# Altium project RK3576-SMC (021.0 A0).PrjPCB (part 3 of 3)

## Sheet RK3576-SMC.LPDDR4 (0021.0 A0).SchDoc
size 420 x 297 mm; Scale: -; DocumentType: Схема электрическая принципиальная; DocumentGOSTLIt1: ㅤ; DocumentGOSTLIt2: ㅤ; DocumentGOSTLIt3: ㅤ; DocumentGOSTNote: Элементы, отмеченные *, используются при трассировке печатной платы, в состав модуля не включаются; SheetNumber: 5; SheetTotal: 6; DocumentTypeShort: Э3; DocumentInvertoryNumber: ㅤ
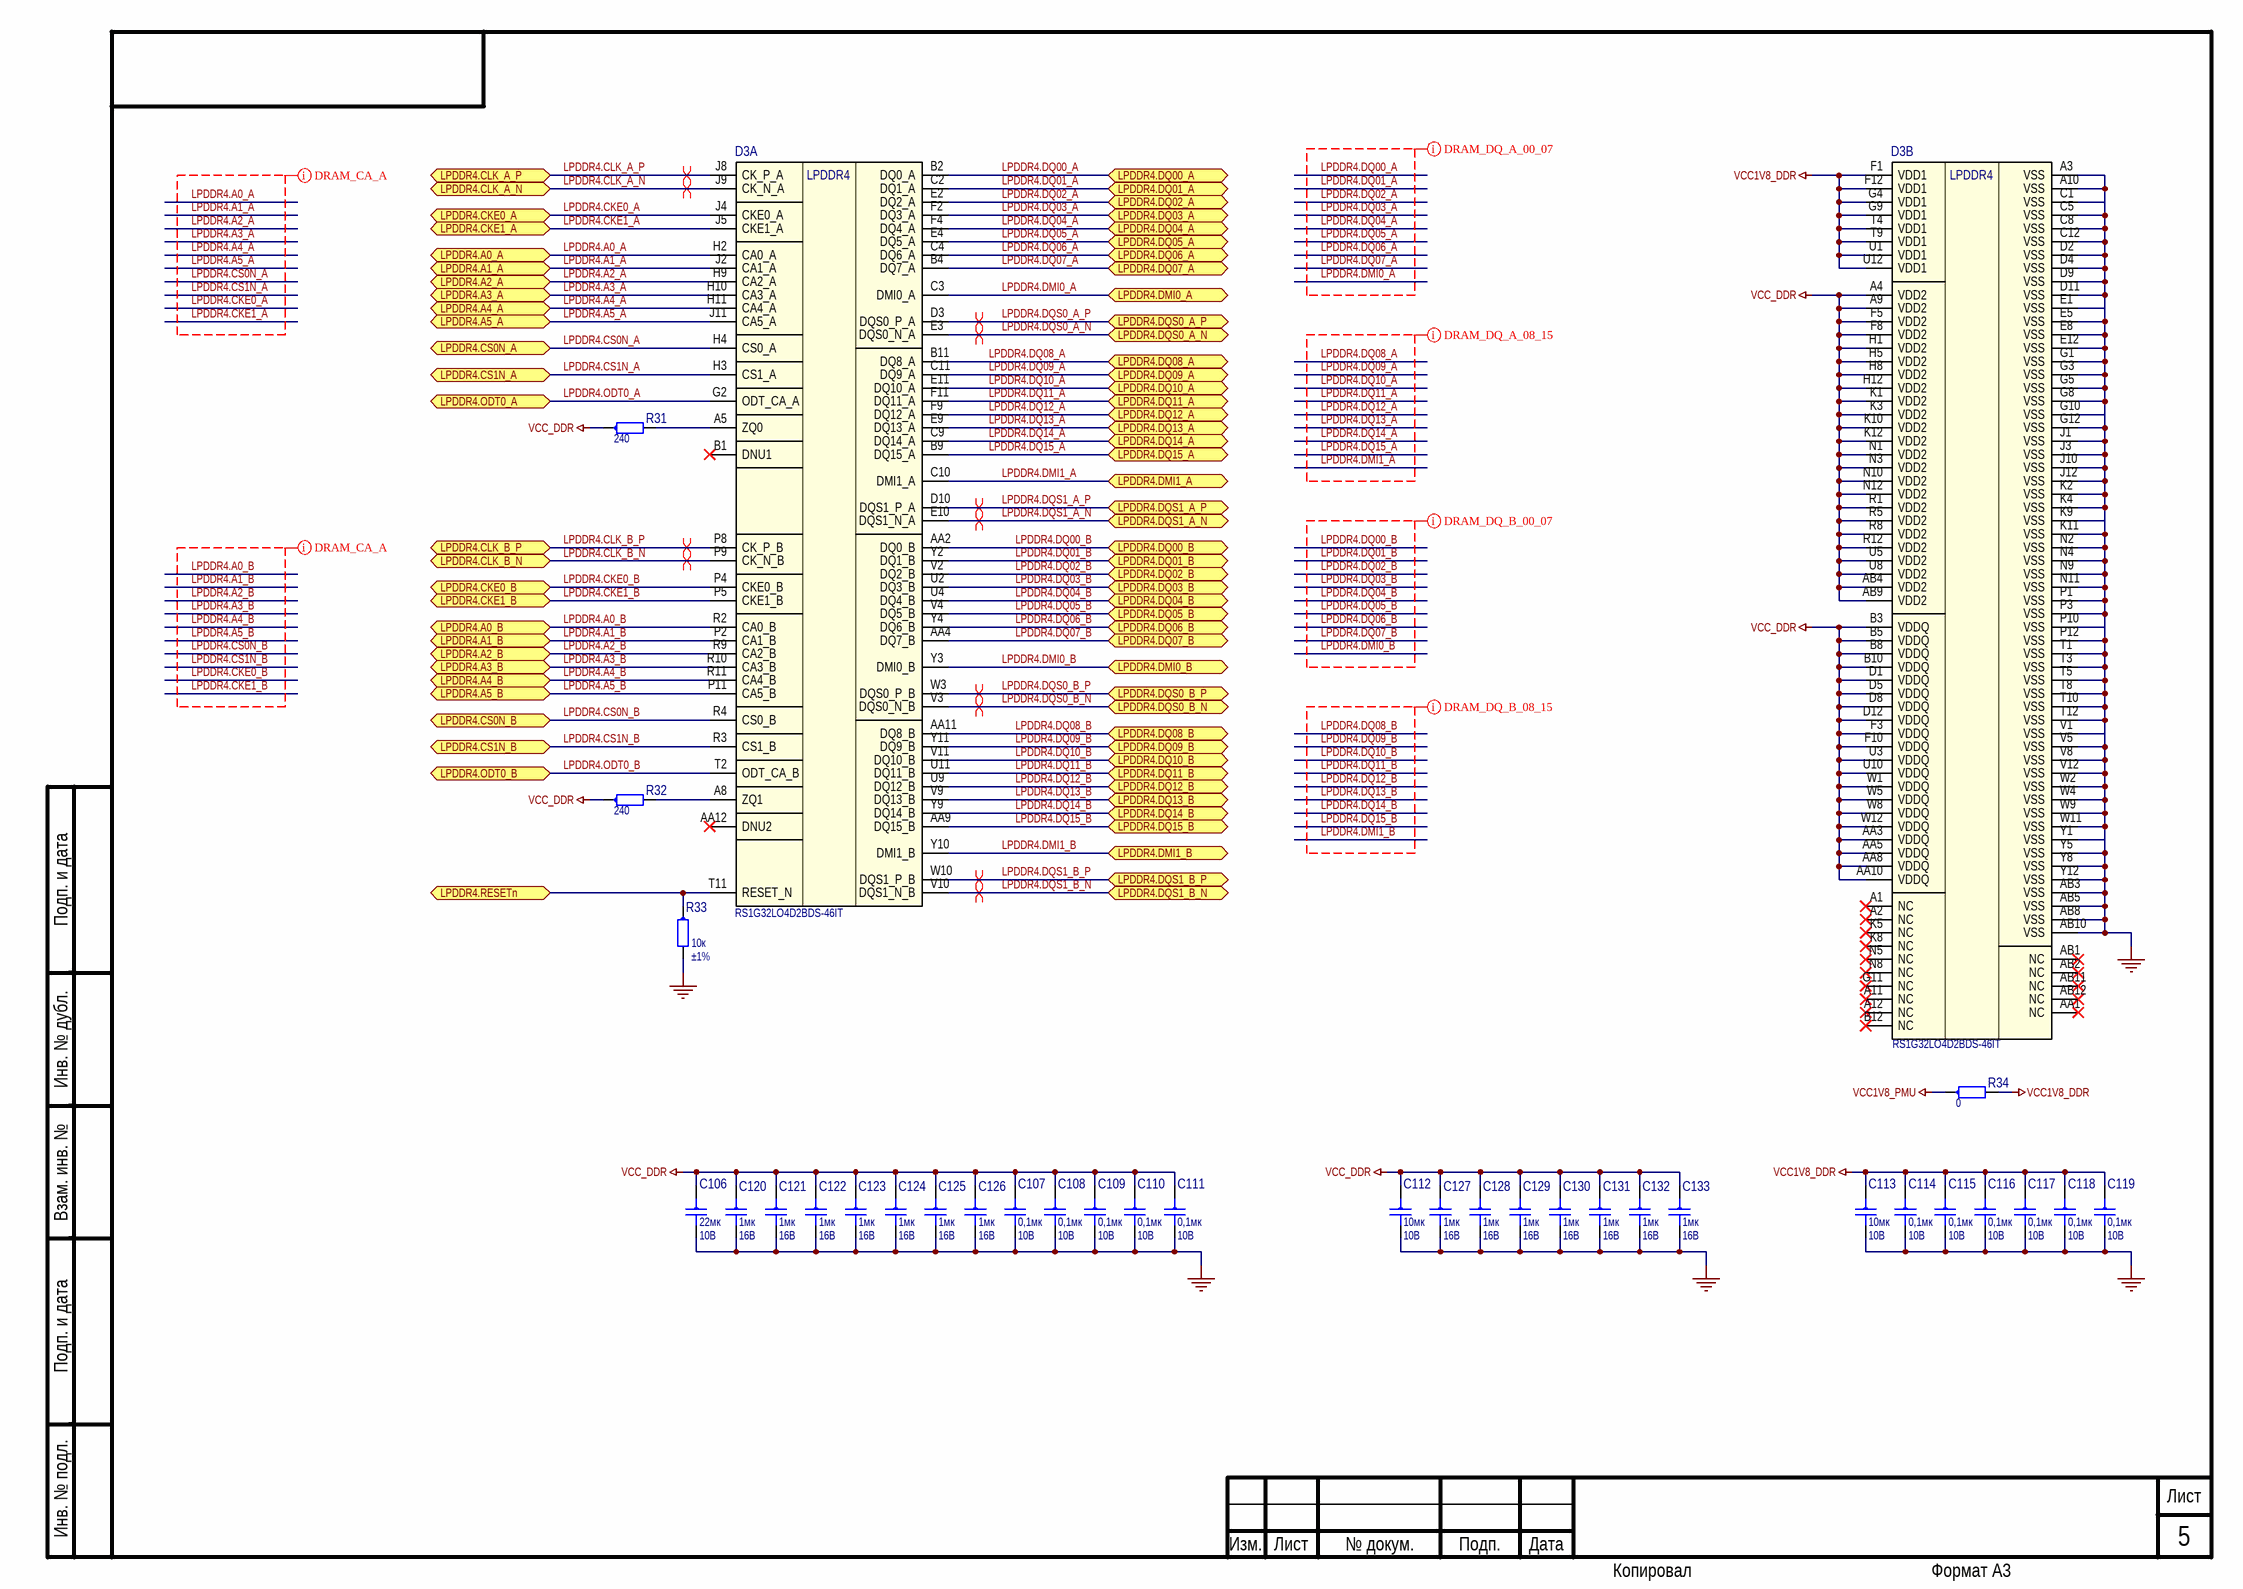
[diagram p5: RK3576-SMC.LPDDR4 (0021.0 A0).SchDoc]

### Parts
C106  22мк  Напряжение: 10В  [capc1608x80n]
C107  0,1мк  Напряжение: 10В  [capc1005x55n]
C108  0,1мк  Напряжение: 10В  [capc1005x55n]
C109  0,1мк  Напряжение: 10В  [capc1005x55n]
C110  0,1мк  Напряжение: 10В  [capc1005x55n]
C111  0,1мк  Напряжение: 10В  [capc1005x55n]
C112  10мк  Напряжение: 10В  [capc1608x100n]
C113  10мк  Напряжение: 10В  [capc1608x100n]
C114  0,1мк  Напряжение: 10В  [capc1005x55n]
C115  0,1мк  Напряжение: 10В  [capc1005x55n]
C116  0,1мк  Напряжение: 10В  [capc1005x55n]
C117  0,1мк  Напряжение: 10В  [capc1005x55n]
C118  0,1мк  Напряжение: 10В  [capc1005x55n]
C119  0,1мк  Напряжение: 10В  [capc1005x55n]
C120  1мк  Напряжение: 16В  [capc1005x55n]
C121  1мк  Напряжение: 16В  [capc1005x55n]
C122  1мк  Напряжение: 16В  [capc1005x55n]
C123  1мк  Напряжение: 16В  [capc1005x55n]
C124  1мк  Напряжение: 16В  [capc1005x55n]
C125  1мк  Напряжение: 16В  [capc1005x55n]
C126  1мк  Напряжение: 16В  [capc1005x55n]
C127  1мк  Напряжение: 16В  [capc1005x55n]
C128  1мк  Напряжение: 16В  [capc1005x55n]
C129  1мк  Напряжение: 16В  [capc1005x55n]
C130  1мк  Напряжение: 16В  [capc1005x55n]
C131  1мк  Напряжение: 16В  [capc1005x55n]
C132  1мк  Напряжение: 16В  [capc1005x55n]
C133  1мк  Напряжение: 16В  [capc1005x55n]
D3  RS1G32LO4D2BDS-46IT  [bga200c80x65p12x22_1000x1450x110]  (parts A,B of 2)
R31  240  [resc1005x40n]
R32  240  [resc1005x40n]
R33  10к  Точность: ±1%  [resc1005x40n]
R34  0  [resc1005x40n]

### Ports
LPDDR4.A0_A (bidir), LPDDR4.A0_B (bidir), LPDDR4.A1_A (bidir), LPDDR4.A1_B (bidir), LPDDR4.A2_A (bidir), LPDDR4.A2_B (bidir), LPDDR4.A3_A (bidir), LPDDR4.A3_B (bidir), LPDDR4.A4_A (bidir), LPDDR4.A4_B (bidir), LPDDR4.A5_A (bidir), LPDDR4.A5_B (bidir), LPDDR4.CKE0_A (bidir), LPDDR4.CKE0_B (bidir), LPDDR4.CKE1_A (bidir), LPDDR4.CKE1_B (bidir), LPDDR4.CLK_A_N (bidir), LPDDR4.CLK_A_P (bidir), LPDDR4.CLK_B_N (bidir), LPDDR4.CLK_B_P (bidir), LPDDR4.CS0N_A (bidir), LPDDR4.CS0N_B (bidir), LPDDR4.CS1N_A (bidir), LPDDR4.CS1N_B (bidir), LPDDR4.DMI0_A (bidir), LPDDR4.DMI0_B (bidir), LPDDR4.DMI1_A (bidir), LPDDR4.DMI1_B (bidir), LPDDR4.DQ00_A (bidir), LPDDR4.DQ00_B (bidir), LPDDR4.DQ01_A (bidir), LPDDR4.DQ01_B (bidir), LPDDR4.DQ02_A (bidir), LPDDR4.DQ02_B (bidir), LPDDR4.DQ03_A (bidir), LPDDR4.DQ03_B (bidir), LPDDR4.DQ04_A (bidir), LPDDR4.DQ04_B (bidir), LPDDR4.DQ05_A (bidir), LPDDR4.DQ05_B (bidir), LPDDR4.DQ06_A (bidir), LPDDR4.DQ06_B (bidir), LPDDR4.DQ07_A (bidir), LPDDR4.DQ07_B (bidir), LPDDR4.DQ08_A (bidir), LPDDR4.DQ08_B (bidir), LPDDR4.DQ09_A (bidir), LPDDR4.DQ09_B (bidir), LPDDR4.DQ10_A (bidir), LPDDR4.DQ10_B (bidir), LPDDR4.DQ11_A (bidir), LPDDR4.DQ11_B (bidir), LPDDR4.DQ12_A (bidir), LPDDR4.DQ12_B (bidir), LPDDR4.DQ13_A (bidir), LPDDR4.DQ13_B (bidir), LPDDR4.DQ14_A (bidir), LPDDR4.DQ14_B (bidir), LPDDR4.DQ15_A (bidir), LPDDR4.DQ15_B (bidir), LPDDR4.DQS0_A_N (bidir), LPDDR4.DQS0_A_P (bidir), LPDDR4.DQS0_B_N (bidir), LPDDR4.DQS0_B_P (bidir), LPDDR4.DQS1_A_N (bidir), LPDDR4.DQS1_A_P (bidir), LPDDR4.DQS1_B_N (bidir), LPDDR4.DQS1_B_P (bidir), LPDDR4.ODT0_A (bidir), LPDDR4.ODT0_B (bidir), LPDDR4.RESETn (bidir)

### Nets
DEV.GND: C106.2 C107.2 C108.2 C109.2 C110.2 C111.2 C112.2 C113.2 C114.2 C115.2 C116.2 C117.2 C118.2 C119.2 C120.2 C121.2 C122.2 C123.2 C124.2 C125.2 C126.2 C127.2 C128.2 C129.2 C130.2 C131.2 C132.2 C133.2 D3.A3(VSS) D3.A10(VSS) D3.AB3(VSS) D3.AB5(VSS) D3.AB8(VSS) D3.AB10(VSS) D3.C1(VSS) D3.C5(VSS) D3.C8(VSS) D3.C12(VSS) D3.D2(VSS) D3.D4(VSS) D3.D9(VSS) D3.D11(VSS) D3.E1(VSS) D3.E5(VSS) D3.E8(VSS) D3.E12(VSS) D3.G1(VSS) D3.G3(VSS) D3.G5(VSS) D3.G8(VSS) D3.G10(VSS) D3.G12(VSS) D3.J1(VSS) D3.J3(VSS) D3.J10(VSS) D3.J12(VSS) D3.K2(VSS) D3.K4(VSS) D3.K9(VSS) D3.K11(VSS) D3.N2(VSS) D3.N4(VSS) D3.N9(VSS) D3.N11(VSS) D3.P1(VSS) D3.P3(VSS) D3.P10(VSS) D3.P12(VSS) D3.T1(VSS) D3.T3(VSS) D3.T5(VSS) D3.T8(VSS) D3.T10(VSS) D3.T12(VSS) D3.V1(VSS) D3.V5(VSS) D3.V8(VSS) D3.V12(VSS) D3.W2(VSS) D3.W4(VSS) D3.W9(VSS) D3.W11(VSS) D3.Y1(VSS) D3.Y5(VSS) D3.Y8(VSS) D3.Y12(VSS) R33.2
VCC1V8_DDR: C113.1 C114.1 C115.1 C116.1 C117.1 C118.1 C119.1 D3.F1(VDD1) D3.F12(VDD1) D3.G4(VDD1) D3.G9(VDD1) D3.T4(VDD1) D3.T9(VDD1) D3.U1(VDD1) D3.U12(VDD1) R34.2
VCC1V8_PMU: R34.1
VCC_DDR: C106.1 C107.1 C108.1 C109.1 C110.1 C111.1 C112.1 C120.1 C121.1 C122.1 C123.1 C124.1 C125.1 C126.1 C127.1 C128.1 C129.1 C130.1 C131.1 C132.1 C133.1 D3.A4(VDD2) D3.A9(VDD2) D3.AA3(VDDQ) D3.AA5(VDDQ) D3.AA8(VDDQ) D3.AA10(VDDQ) D3.AB4(VDD2) D3.AB9(VDD2) D3.B3(VDDQ) D3.B5(VDDQ) D3.B8(VDDQ) D3.B10(VDDQ) D3.D1(VDDQ) D3.D5(VDDQ) D3.D8(VDDQ) D3.D12(VDDQ) D3.F3(VDDQ) D3.F5(VDD2) D3.F8(VDD2) D3.F10(VDDQ) D3.H1(VDD2) D3.H5(VDD2) D3.H8(VDD2) D3.H12(VDD2) D3.K1(VDD2) D3.K3(VDD2) D3.K10(VDD2) D3.K12(VDD2) D3.N1(VDD2) D3.N3(VDD2) D3.N10(VDD2) D3.N12(VDD2) D3.R1(VDD2) D3.R5(VDD2) D3.R8(VDD2) D3.R12(VDD2) D3.U3(VDDQ) D3.U5(VDD2) D3.U8(VDD2) D3.U10(VDDQ) D3.W1(VDDQ) D3.W5(VDDQ) D3.W8(VDDQ) D3.W12(VDDQ) R31.1 R32.1
LPDDR4.A0_A: D3.H2(CA0_A) ; port LPDDR4.A0_A
LPDDR4.A0_B: D3.R2(CA0_B) ; port LPDDR4.A0_B
LPDDR4.A1_A: D3.J2(CA1_A) ; port LPDDR4.A1_A
LPDDR4.A1_B: D3.P2(CA1_B) ; port LPDDR4.A1_B
LPDDR4.A2_A: D3.H9(CA2_A) ; port LPDDR4.A2_A
LPDDR4.A2_B: D3.R9(CA2_B) ; port LPDDR4.A2_B
LPDDR4.A3_A: D3.H10(CA3_A) ; port LPDDR4.A3_A
LPDDR4.A3_B: D3.R10(CA3_B) ; port LPDDR4.A3_B
LPDDR4.A4_A: D3.H11(CA4_A) ; port LPDDR4.A4_A
LPDDR4.A4_B: D3.R11(CA4_B) ; port LPDDR4.A4_B
LPDDR4.A5_A: D3.J11(CA5_A) ; port LPDDR4.A5_A
LPDDR4.A5_B: D3.P11(CA5_B) ; port LPDDR4.A5_B
LPDDR4.CKE0_A: D3.J4(CKE0_A) ; port LPDDR4.CKE0_A
LPDDR4.CKE0_B: D3.P4(CKE0_B) ; port LPDDR4.CKE0_B
LPDDR4.CKE1_A: D3.J5(CKE1_A) ; port LPDDR4.CKE1_A
LPDDR4.CKE1_B: D3.P5(CKE1_B) ; port LPDDR4.CKE1_B
LPDDR4.CLK_A_N: D3.J9(CK_N_A) ; port LPDDR4.CLK_A_N
LPDDR4.CLK_A_P: D3.J8(CK_P_A) ; port LPDDR4.CLK_A_P
LPDDR4.CLK_B_N: D3.P9(CK_N_B) ; port LPDDR4.CLK_B_N
LPDDR4.CLK_B_P: D3.P8(CK_P_B) ; port LPDDR4.CLK_B_P
LPDDR4.CS0N_A: D3.H4(CS0_A) ; port LPDDR4.CS0N_A
LPDDR4.CS0N_B: D3.R4(CS0_B) ; port LPDDR4.CS0N_B
LPDDR4.CS1N_A: D3.H3(CS1_A) ; port LPDDR4.CS1N_A
LPDDR4.CS1N_B: D3.R3(CS1_B) ; port LPDDR4.CS1N_B
LPDDR4.DMI0_A: D3.C3(DMI0_A) ; port LPDDR4.DMI0_A
LPDDR4.DMI0_B: D3.Y3(DMI0_B) ; port LPDDR4.DMI0_B
LPDDR4.DMI1_A: D3.C10(DMI1_A) ; port LPDDR4.DMI1_A
LPDDR4.DMI1_B: D3.Y10(DMI1_B) ; port LPDDR4.DMI1_B
LPDDR4.DQ00_A: D3.B2(DQ0_A) ; port LPDDR4.DQ00_A
LPDDR4.DQ00_B: D3.AA2(DQ0_B) ; port LPDDR4.DQ00_B
LPDDR4.DQ01_A: D3.C2(DQ1_A) ; port LPDDR4.DQ01_A
LPDDR4.DQ01_B: D3.Y2(DQ1_B) ; port LPDDR4.DQ01_B
LPDDR4.DQ02_A: D3.E2(DQ2_A) ; port LPDDR4.DQ02_A
LPDDR4.DQ02_B: D3.V2(DQ2_B) ; port LPDDR4.DQ02_B
LPDDR4.DQ03_A: D3.F2(DQ3_A) ; port LPDDR4.DQ03_A
LPDDR4.DQ03_B: D3.U2(DQ3_B) ; port LPDDR4.DQ03_B
LPDDR4.DQ04_A: D3.F4(DQ4_A) ; port LPDDR4.DQ04_A
LPDDR4.DQ04_B: D3.U4(DQ4_B) ; port LPDDR4.DQ04_B
LPDDR4.DQ05_A: D3.E4(DQ5_A) ; port LPDDR4.DQ05_A
LPDDR4.DQ05_B: D3.V4(DQ5_B) ; port LPDDR4.DQ05_B
LPDDR4.DQ06_A: D3.C4(DQ6_A) ; port LPDDR4.DQ06_A
LPDDR4.DQ06_B: D3.Y4(DQ6_B) ; port LPDDR4.DQ06_B
LPDDR4.DQ07_A: D3.B4(DQ7_A) ; port LPDDR4.DQ07_A
LPDDR4.DQ07_B: D3.AA4(DQ7_B) ; port LPDDR4.DQ07_B
LPDDR4.DQ08_A: D3.B11(DQ8_A) ; port LPDDR4.DQ08_A
LPDDR4.DQ08_B: D3.AA11(DQ8_B) ; port LPDDR4.DQ08_B
LPDDR4.DQ09_A: D3.C11(DQ9_A) ; port LPDDR4.DQ09_A
LPDDR4.DQ09_B: D3.Y11(DQ9_B) ; port LPDDR4.DQ09_B
LPDDR4.DQ10_A: D3.E11(DQ10_A) ; port LPDDR4.DQ10_A
LPDDR4.DQ10_B: D3.V11(DQ10_B) ; port LPDDR4.DQ10_B
LPDDR4.DQ11_A: D3.F11(DQ11_A) ; port LPDDR4.DQ11_A
LPDDR4.DQ11_B: D3.U11(DQ11_B) ; port LPDDR4.DQ11_B
LPDDR4.DQ12_A: D3.F9(DQ12_A) ; port LPDDR4.DQ12_A
LPDDR4.DQ12_B: D3.U9(DQ12_B) ; port LPDDR4.DQ12_B
LPDDR4.DQ13_A: D3.E9(DQ13_A) ; port LPDDR4.DQ13_A
LPDDR4.DQ13_B: D3.V9(DQ13_B) ; port LPDDR4.DQ13_B
LPDDR4.DQ14_A: D3.C9(DQ14_A) ; port LPDDR4.DQ14_A
LPDDR4.DQ14_B: D3.Y9(DQ14_B) ; port LPDDR4.DQ14_B
LPDDR4.DQ15_A: D3.B9(DQ15_A) ; port LPDDR4.DQ15_A
LPDDR4.DQ15_B: D3.AA9(DQ15_B) ; port LPDDR4.DQ15_B
LPDDR4.DQS0_A_N: D3.E3(DQS0_N_A) ; port LPDDR4.DQS0_A_N
LPDDR4.DQS0_A_P: D3.D3(DQS0_P_A) ; port LPDDR4.DQS0_A_P
LPDDR4.DQS0_B_N: D3.V3(DQS0_N_B) ; port LPDDR4.DQS0_B_N
LPDDR4.DQS0_B_P: D3.W3(DQS0_P_B) ; port LPDDR4.DQS0_B_P
LPDDR4.DQS1_A_N: D3.E10(DQS1_N_A) ; port LPDDR4.DQS1_A_N
LPDDR4.DQS1_A_P: D3.D10(DQS1_P_A) ; port LPDDR4.DQS1_A_P
LPDDR4.DQS1_B_N: D3.V10(DQS1_N_B) ; port LPDDR4.DQS1_B_N
LPDDR4.DQS1_B_P: D3.W10(DQS1_P_B) ; port LPDDR4.DQS1_B_P
LPDDR4.ODT0_A: D3.G2(ODT_CA_A) ; port LPDDR4.ODT0_A
LPDDR4.ODT0_B: D3.T2(ODT_CA_B) ; port LPDDR4.ODT0_B
NetD3_A5: D3.A5(ZQ0) R31.2
NetD3_A8: D3.A8(ZQ1) R32.2
NetD3_T11: D3.T11(RESET_N) R33.1 ; port LPDDR4.RESETn

Not connected (* = marked no-connect by the designer): D3 A1(NC)* A2(NC)* A11(NC)* A12(NC)* AA1(NC)* AA12(DNU2)* AB1(NC)* AB2(NC)* AB11(NC)* AB12(NC)* B1(DNU1)* B12(NC)* G11(NC)* K5(NC)* K8(NC)* N5(NC)* N8(NC)*

### Layout directives
differential pair; differential pair class LPDDR4_STROBE0_A_Diff; rule Differential Pairs Routing [Pref Gap = 0.15mm    Min Gap  = 0.15mm    Max Gap  = 0.15mmPref Width = 0.15mm    Min Width  = 0.15mm    Max Width  = 0.15mm]: LPDDR4.DQS0_A_N, LPDDR4.DQS0_A_P
net class DRAM_DQ_A_00_07; rule Length Constraint [Min Length = 0mm    Max Length = 150mm]; rule Width Constraint [Pref Impedance = 50,00ohms    Min Impedance = 50,00ohms    Max Impedance = 50,00ohms]: LPDDR4.A0_A, LPDDR4.A0_B, LPDDR4.A1_A, LPDDR4.A1_B, LPDDR4.A2_A, LPDDR4.A2_B, LPDDR4.A3_A, LPDDR4.A3_B, LPDDR4.A4_A, LPDDR4.A4_B, LPDDR4.A5_A, LPDDR4.A5_B, LPDDR4.CKE0_A, LPDDR4.CKE0_B, LPDDR4.CKE1_A, LPDDR4.CKE1_B, LPDDR4.CS0N_A, LPDDR4.CS0N_B, LPDDR4.CS1N_A, LPDDR4.CS1N_B, LPDDR4.DMI0_A, LPDDR4.DQ00_A, LPDDR4.DQ01_A, LPDDR4.DQ02_A, LPDDR4.DQ03_A, LPDDR4.DQ04_A, LPDDR4.DQ05_A, LPDDR4.DQ06_A, LPDDR4.DQ07_A
net class DRAM_DQ_A_08_15; rule Length Constraint [Min Delay = 1ps    Max Delay = 1ps]; rule Width Constraint [Pref Impedance = 50,00ohms    Min Impedance = 50,00ohms    Max Impedance = 50,00ohms]: LPDDR4.DMI1_A, LPDDR4.DQ08_A, LPDDR4.DQ09_A, LPDDR4.DQ10_A, LPDDR4.DQ11_A, LPDDR4.DQ12_A, LPDDR4.DQ13_A, LPDDR4.DQ14_A, LPDDR4.DQ15_A
differential pair; differential pair class LPDDR4_STROBE1_A_Diff; rule Differential Pairs Routing [Pref Gap = 0.15mm    Min Gap  = 0.15mm    Max Gap  = 0.15mmPref Width = 0.15mm    Min Width  = 0.15mm    Max Width  = 0.15mm]: LPDDR4.DQS1_A_N, LPDDR4.DQS1_A_P
differential pair; differential pair class LPDDR4_STROBE0_B_Diff; rule Differential Pairs Routing [Pref Gap = 0.15mm    Min Gap  = 0.15mm    Max Gap  = 0.15mmPref Width = 0.15mm    Min Width  = 0.15mm    Max Width  = 0.15mm]: LPDDR4.DQS0_B_N, LPDDR4.DQS0_B_P
net class DRAM_DQ_B_00_07; rule Length Constraint [Min Length = 0mm    Max Length = 150mm]; rule Width Constraint [Pref Impedance = 50,00ohms    Min Impedance = 50,00ohms    Max Impedance = 50,00ohms]: LPDDR4.DMI0_B, LPDDR4.DQ00_B, LPDDR4.DQ01_B, LPDDR4.DQ02_B, LPDDR4.DQ03_B, LPDDR4.DQ04_B, LPDDR4.DQ05_B, LPDDR4.DQ06_B, LPDDR4.DQ07_B
net class DRAM_DQ_B_08_15; rule Length Constraint [Min Delay = 1ps    Max Delay = 1ps]; rule Width Constraint [Pref Impedance = 50,00ohms    Min Impedance = 50,00ohms    Max Impedance = 50,00ohms]: LPDDR4.DMI1_B, LPDDR4.DQ08_B, LPDDR4.DQ09_B, LPDDR4.DQ10_B, LPDDR4.DQ11_B, LPDDR4.DQ12_B, LPDDR4.DQ13_B, LPDDR4.DQ14_B, LPDDR4.DQ15_B
differential pair; differential pair class LPDDR4_STROBE1_B_Diff; rule Differential Pairs Routing [Pref Gap = 0.15mm    Min Gap  = 0.15mm    Max Gap  = 0.15mmPref Width = 0.15mm    Min Width  = 0.15mm    Max Width  = 0.15mm]: LPDDR4.DQS1_B_N, LPDDR4.DQS1_B_P
differential pair; differential pair class LPDDR4.CLK_A; rule Differential Pairs Routing [Pref Gap = 0.15mm    Min Gap  = 0.15mm    Max Gap  = 0.15mmPref Width = 0.15mm    Min Width  = 0.15mm    Max Width  = 0.15mm]: LPDDR4.CLK_A_N, LPDDR4.CLK_A_P
differential pair; differential pair class LPDDR4.CLK_B; rule Differential Pairs Routing [Pref Gap = 0.15mm    Min Gap  = 0.15mm    Max Gap  = 0.15mmPref Width = 0.15mm    Min Width  = 0.15mm    Max Width  = 0.15mm]: LPDDR4.CLK_B_N, LPDDR4.CLK_B_P

### Notes on the sheet
- Подп. и дата
- Инв. № дубл.
- Взам. инв. №
- Инв. № подл.
- Изм.
- Лист
- № докум.
- Подп.
- Дата
- Копировал
- Формат А3
- (in symbol RS1G32LO4D2BDS-46IT, part A) LPDDR4
- (in symbol RS1G32LO4D2BDS-46IT, part B) LPDDR4

### Library data of the parts
C106 = GRM187R61A226ME15D: Part_ID: ATB-00599; Manufacturer: Murata; Schematic_Part: C_min_val,C_min,C_val,C; Тип ЭКБ: Конденсаторы; Наименование: 0603-X5R-10V-22uF±20%; Тип компонента: Конденсатор керамический; Value: 22uF; Voltage: 10V; Температура: -55 +85; Тип корпуса: Chip; Видоразмер: 1608; Вариант установки: Поверхностный; Код ERP: E2-00012963; Photo: Murata_GRM155.jpg; Автор: Чепиков И.В.; Точность: 20%; Device: 0603-X5R-10V-22uF±20%_Murata; Library Ref 2: C; Library Ref 3: Cshort; Part Number: GRM187R61A226ME15D; Datasheet: GRM187R61A226ME15.pdf; Номинал: 22мк; Part_Number: GRM187R61A226ME15D; PCB_Footprint: capc1608x80n; Weight: 0.0091; Height: 0.8; Производитель: Murata; Website: https://www.murata.com/en-us/products/productdetail?partno=GRM187R61A226ME15%23; Дата: 03.09.2024; ComponentLink1Description: GRM187R61A226ME15.pdf; ComponentLink1URL: https://www.murata.com/en-us/products/productdetail?partno=GRM187R61A226ME15%23; NameFromManufacturer: GRM187R61A226ME15D; Original PN: GRM187R61A226ME15D
C107-C111 C114-C119 = C0402C104K8RAC: Part_ID: ATB-04706; Manufacturer: Kemet; Schematic_Part: C_min_val,C_min,C_val,C; Тип ЭКБ: Конденсаторы; Наименование: 0402-X7R-10V-100nF±10%; Тип компонента: Конденсатор керамический; Value: 100nF; Voltage: 10V; Температура: -55 +125; PCB_Footprint: capc1005x55,capc1005x55n; Тип корпуса: Chip; Видоразмер: 1005; Вариант установки: Поверхностный; Photo: Kemet_C0402-C2225.jpg; Автор: Чепиков И.В.; Точность: 10%; Device: 0402-X7R-10V-100nF±10%_Kemet; Library Ref 2: C; Library Ref 3: Cshort; Part Number: C0402C104K8RAC; Datasheet: Kemet_6.3-250V_X7R.pdf; Номинал: 0,1мк; Part_Number: C0402C104K8RAC; Height: 0.55; Производитель: Kemet; Website: https://content.kemet.com/datasheets/KEM_C1002_X7R_SMD.pdf; Дата: 16.10.2024; ComponentLink1Description: Kemet_6.3-250V_X7R.pdf; ComponentLink1URL: https://content.kemet.com/datasheets/KEM_C1002_X7R_SMD.pdf; NameFromManufacturer: C0402C104K8RAC; Original PN: C0402C104K8RAC
C112 C113 = CC0603KRX5R6BB106: Part_ID: ATB-01068; Manufacturer: Yageo; Schematic_Part: C_min_val,C_min,C_val,C; Тип ЭКБ: Конденсаторы; Наименование: 0603-X5R-10V-10uF±10%; Тип компонента: Конденсатор керамический; Value: 10uF; Voltage: 10V; Температура: -55 +85; Тип корпуса: Chip; Видоразмер: 1608; Вариант установки: Поверхностный; Код ERP: E2-00029011; Photo: Yageo_Capacitors.jpg; Автор: Чепиков И.В.; Точность: 10%; Device: 0603-X5R-10V-10uF±10%_Yageo; Library Ref 2: C; Library Ref 3: Cshort; Part Number: CC0603KRX5R6BB106; Datasheet: UPY-GPHC_X5R_4V-to-50V_30.pdf; Номинал: 10мк; Part_Number: CC0603KRX5R6BB106; PCB_Footprint: capc1608x100n; Height: 1; Производитель: Yageo; Website: https://www.yageo.com/upload/media/product/productsearch/datasheet/mlcc/UPY-GPHC_X5R_4V-to-50V_30.pdf; Дата: 25.09.2024; ComponentLink1Description: UPY-GPHC_X5R_4V-to-50V_30.pdf; ComponentLink1URL: https://www.yageo.com/upload/media/product/productsearch/datasheet/mlcc/UPY-GPHC_X5R_4V-to-50V_30.pdf; NameFromManufacturer: CC0603KRX5R6BB106; Original PN: CC0603KRX5R6BB106
C120-C133 = CC0402KRX5R7BB105: Part_ID: ATB-01023; Manufacturer: Yageo; Schematic_Part: C_min_val,C_min,C_val,C; Тип ЭКБ: Конденсаторы; Наименование: 0402-X5R-16V-1uF±10%; Тип компонента: Конденсатор керамический; Value: 1uF; Voltage: 16V; Температура: -55 +85; PCB_Footprint: capc1005x55,capc1005x55n; Тип корпуса: Chip; Видоразмер: 1005; Вариант установки: Поверхностный; Код ERP: E2-00033521; Photo: Yageo_Capacitors.jpg; Автор: Чепиков И.В.; Точность: 10%; Device: 0402-X5R-16V-1uF±10%_Yageo; Library Ref 2: C; Library Ref 3: Cshort; Part Number: CC0402KRX5R7BB105; Datasheet: UPY-GPHC_X5R_4V-to-50V_30.pdf; Номинал: 1мк; Part_Number: CC0402KRX5R7BB105; Height: 0.55; Производитель: Yageo; Website: https://www.yageo.com/upload/media/product/productsearch/datasheet/mlcc/UPY-GPHC_X5R_4V-to-50V_30.pdf; Дата: 25.09.2024; ComponentLink1Description: UPY-GPHC_X5R_4V-to-50V_30.pdf; ComponentLink1URL: https://www.yageo.com/upload/media/product/productsearch/datasheet/mlcc/UPY-GPHC_X5R_4V-to-50V_30.pdf; NameFromManufacturer: CC0402KRX5R7BB105; Original PN: CC0402KRX5R7BB105
D3 = RS1G32LO4D2BDS-46IT: LPDDR4 SDRAM configuration 32Gb, 1Gig x 32; Part_ID: ATB-09741; Manufacturer: Rayson Technology; Тип ЭКБ: Микросхемы; Тип компонента: SDRAM\DDR4; Voltage: 0.6 - 1.8; Температура: -40 +95; Тип корпуса: BGA10x14.5-200; Вариант установки: Поверхностный; Код ERP: E2-00008803; Photo: Micron_MT53D1024M32D4DT-046_AIT_D.jpg; Автор: Чепиков И.В.; Part Number: RS1G32LO4D2BDS-46IT; Наименование: RS1G32LO4D2BDS-46IT; Datasheet: RS1G32LO4D2BDS_46IT_V1.1.pdf; Schematic_Part: MT53E256M32D2DS; Value: RS1G32LO4D2BDS-46IT; Part_Number: RS1G32LO4D2BDS-46IT; PCB_Footprint: bga200c80x65p12x22_1000x1450x110; Height: 1.1; Производитель: Rayson Technology; Website: https://mt-system.ru/catalog/poluprovodniki/mikroskhemy_pamyati/dram/lpddr4/3587/?sphrase_id=31402; Дата: 16.01.2025; Device: RS1G32LO4D2BDS-46IT; ComponentLink1Description: RS1G32LO4D2BDS_46IT_V1.1.pdf; ComponentLink1URL: https://mt-system.ru/catalog/poluprovodniki/mikroskhemy_pamyati/dram/lpddr4/3587/?sphrase_id=31402; NameFromManufacturer: RS1G32LO4D2BDS-46IT; Original PN: RS1G32LO4D2BDS-46IT
R31 R32 = RC0402FR-07240RL: Part_ID: ATB-00788; Manufacturer: Yageo; Schematic_Part: R_min_val,R_min,R_val,R; Тип ЭКБ: Резисторы; Наименование: 0402-0.063W-240-100ppm±1%; Тип компонента: Резистор; Voltage: 50V; Power: 0.063; Точность: ±1%; ТКС (от  -60 до +20 град): ± 100; Ряд: E24; Температура: -55 +155; Тип корпуса: Chip; Вариант установки: Поверхностный; Код ERP: E2-00029038; Photo: Yageo_RC0075-RC2512.jpg; Автор: Чепиков И.В.; Device: 0402-0.063W-240-100ppm±1%_Yageo; Library Ref 2: R; Part Number: RC0402FR-07240RL; Datasheet: PYu-RC_Group_51_RoHS_L_12.pdf; Номинал: 240; Value: 240; ТКС (от +20 град до max): ± 100; Part_Number: RC0402FR-07240RL; PCB_Footprint: resc1005x40n; Height: 0.4; Производитель: Yageo; Website: https://www.yageo.com/upload/media/product/products/datasheet/rchip/PYu-RC_Group_51_RoHS_L_12.pdf; Дата: 25.09.2024; NameFromManufacturer: RC0402FR-07240RL; ComponentLink1URL: https://www.yageo.com/upload/media/product/products/datasheet/rchip/PYu-RC_Group_51_RoHS_L_12.pdf; ComponentLink1Description: PYu-RC_Group_51_RoHS_L_12.pdf; Original PN: RC0402FR-07240RL
R33 = RC0402FR-0710KL: Part_ID: ATB-00523; Manufacturer: Yageo; Schematic_Part: R_min_val,R_min,R_val,R; Тип ЭКБ: Резисторы; Наименование: 0402-0.063W-10K-100ppm±1%; Тип компонента: Резистор; Value: 10k; Voltage: 50V; Power: 0.063; ТКС (от  -60 до +20 град): ± 100; Ряд: E24; Температура: -55 +155; Тип корпуса: Chip; Вариант установки: Поверхностный; Код ERP: E2-00004079; Photo: Yageo_RC0075-RC2512.jpg; Автор: Чепиков И.В.; Device: 0402-0.063W-10K-100ppm±1%_Yageo; Library Ref 2: R; Part Number: RC0402FR-0710KL; Datasheet: PYu-RC_Group_51_RoHS_L_12.pdf; Номинал: 10к; ТКС (от +20 град до max): ± 100; Part_Number: RC0402FR-0710KL; PCB_Footprint: resc1005x40n; Height: 0.4; Производитель: Yageo; Website: https://www.yageo.com/upload/media/product/products/datasheet/rchip/PYu-RC_Group_51_RoHS_L_12.pdf; Дата: 23.08.2024; NameFromManufacturer: RC0402FR-0710KL; ComponentLink1URL: https://www.yageo.com/upload/media/product/products/datasheet/rchip/PYu-RC_Group_51_RoHS_L_12.pdf; ComponentLink1Description: PYu-RC_Group_51_RoHS_L_12.pdf; Original PN: RC0402FR-0710KL
R34 = RC0402JR-070RL: Part_ID: ATB-00732; Manufacturer: Yageo; Schematic_Part: R_min_val,R_min,R_val,R; Тип ЭКБ: Резисторы; Наименование: 0402-0.063W-0±5%; Тип компонента: Резистор; Voltage: 50V; Power: 0.063; Точность: ±5%; Температура: -55 +155; Тип корпуса: Chip; Вариант установки: Поверхностный; Код ERP: E2-00036287; Photo: Yageo_RC0075-RC2512.jpg; Автор: Чепиков И.В.; Device: 0402-0.063W-0±5%_Yageo; Library Ref 2: R; Part Number: RC0402JR-070RL; Datasheet: PYu-RC_Group_51_RoHS_L_12.pdf; Номинал: 0; Value: 0; Part_Number: RC0402JR-070RL; PCB_Footprint: resc1005x40n; Height: 0.4; Производитель: Yageo; Website: https://www.yageo.com/upload/media/product/products/datasheet/rchip/PYu-RC_Group_51_RoHS_L_12.pdf; Дата: 25.09.2024; NameFromManufacturer: RC0402JR-070RL; ComponentLink1URL: https://www.yageo.com/upload/media/product/products/datasheet/rchip/PYu-RC_Group_51_RoHS_L_12.pdf; ComponentLink1Description: PYu-RC_Group_51_RoHS_L_12.pdf; Original PN: RC0402JR-070RL

## Sheet RK3576-SMC.EMMC (0021.0 A0).SchDoc
size 420 x 297 mm; Scale: -; DocumentType: Схема электрическая принципиальная; DocumentGOSTLIt1: ㅤ; DocumentGOSTLIt2: ㅤ; DocumentGOSTLIt3: ㅤ; DocumentGOSTNote: Элементы, отмеченные *, используются при трассировке печатной платы, в состав модуля не включаются; SheetNumber: 4; SheetTotal: 4; DocumentTypeShort: Э3; DocumentInvertoryNumber: ㅤ
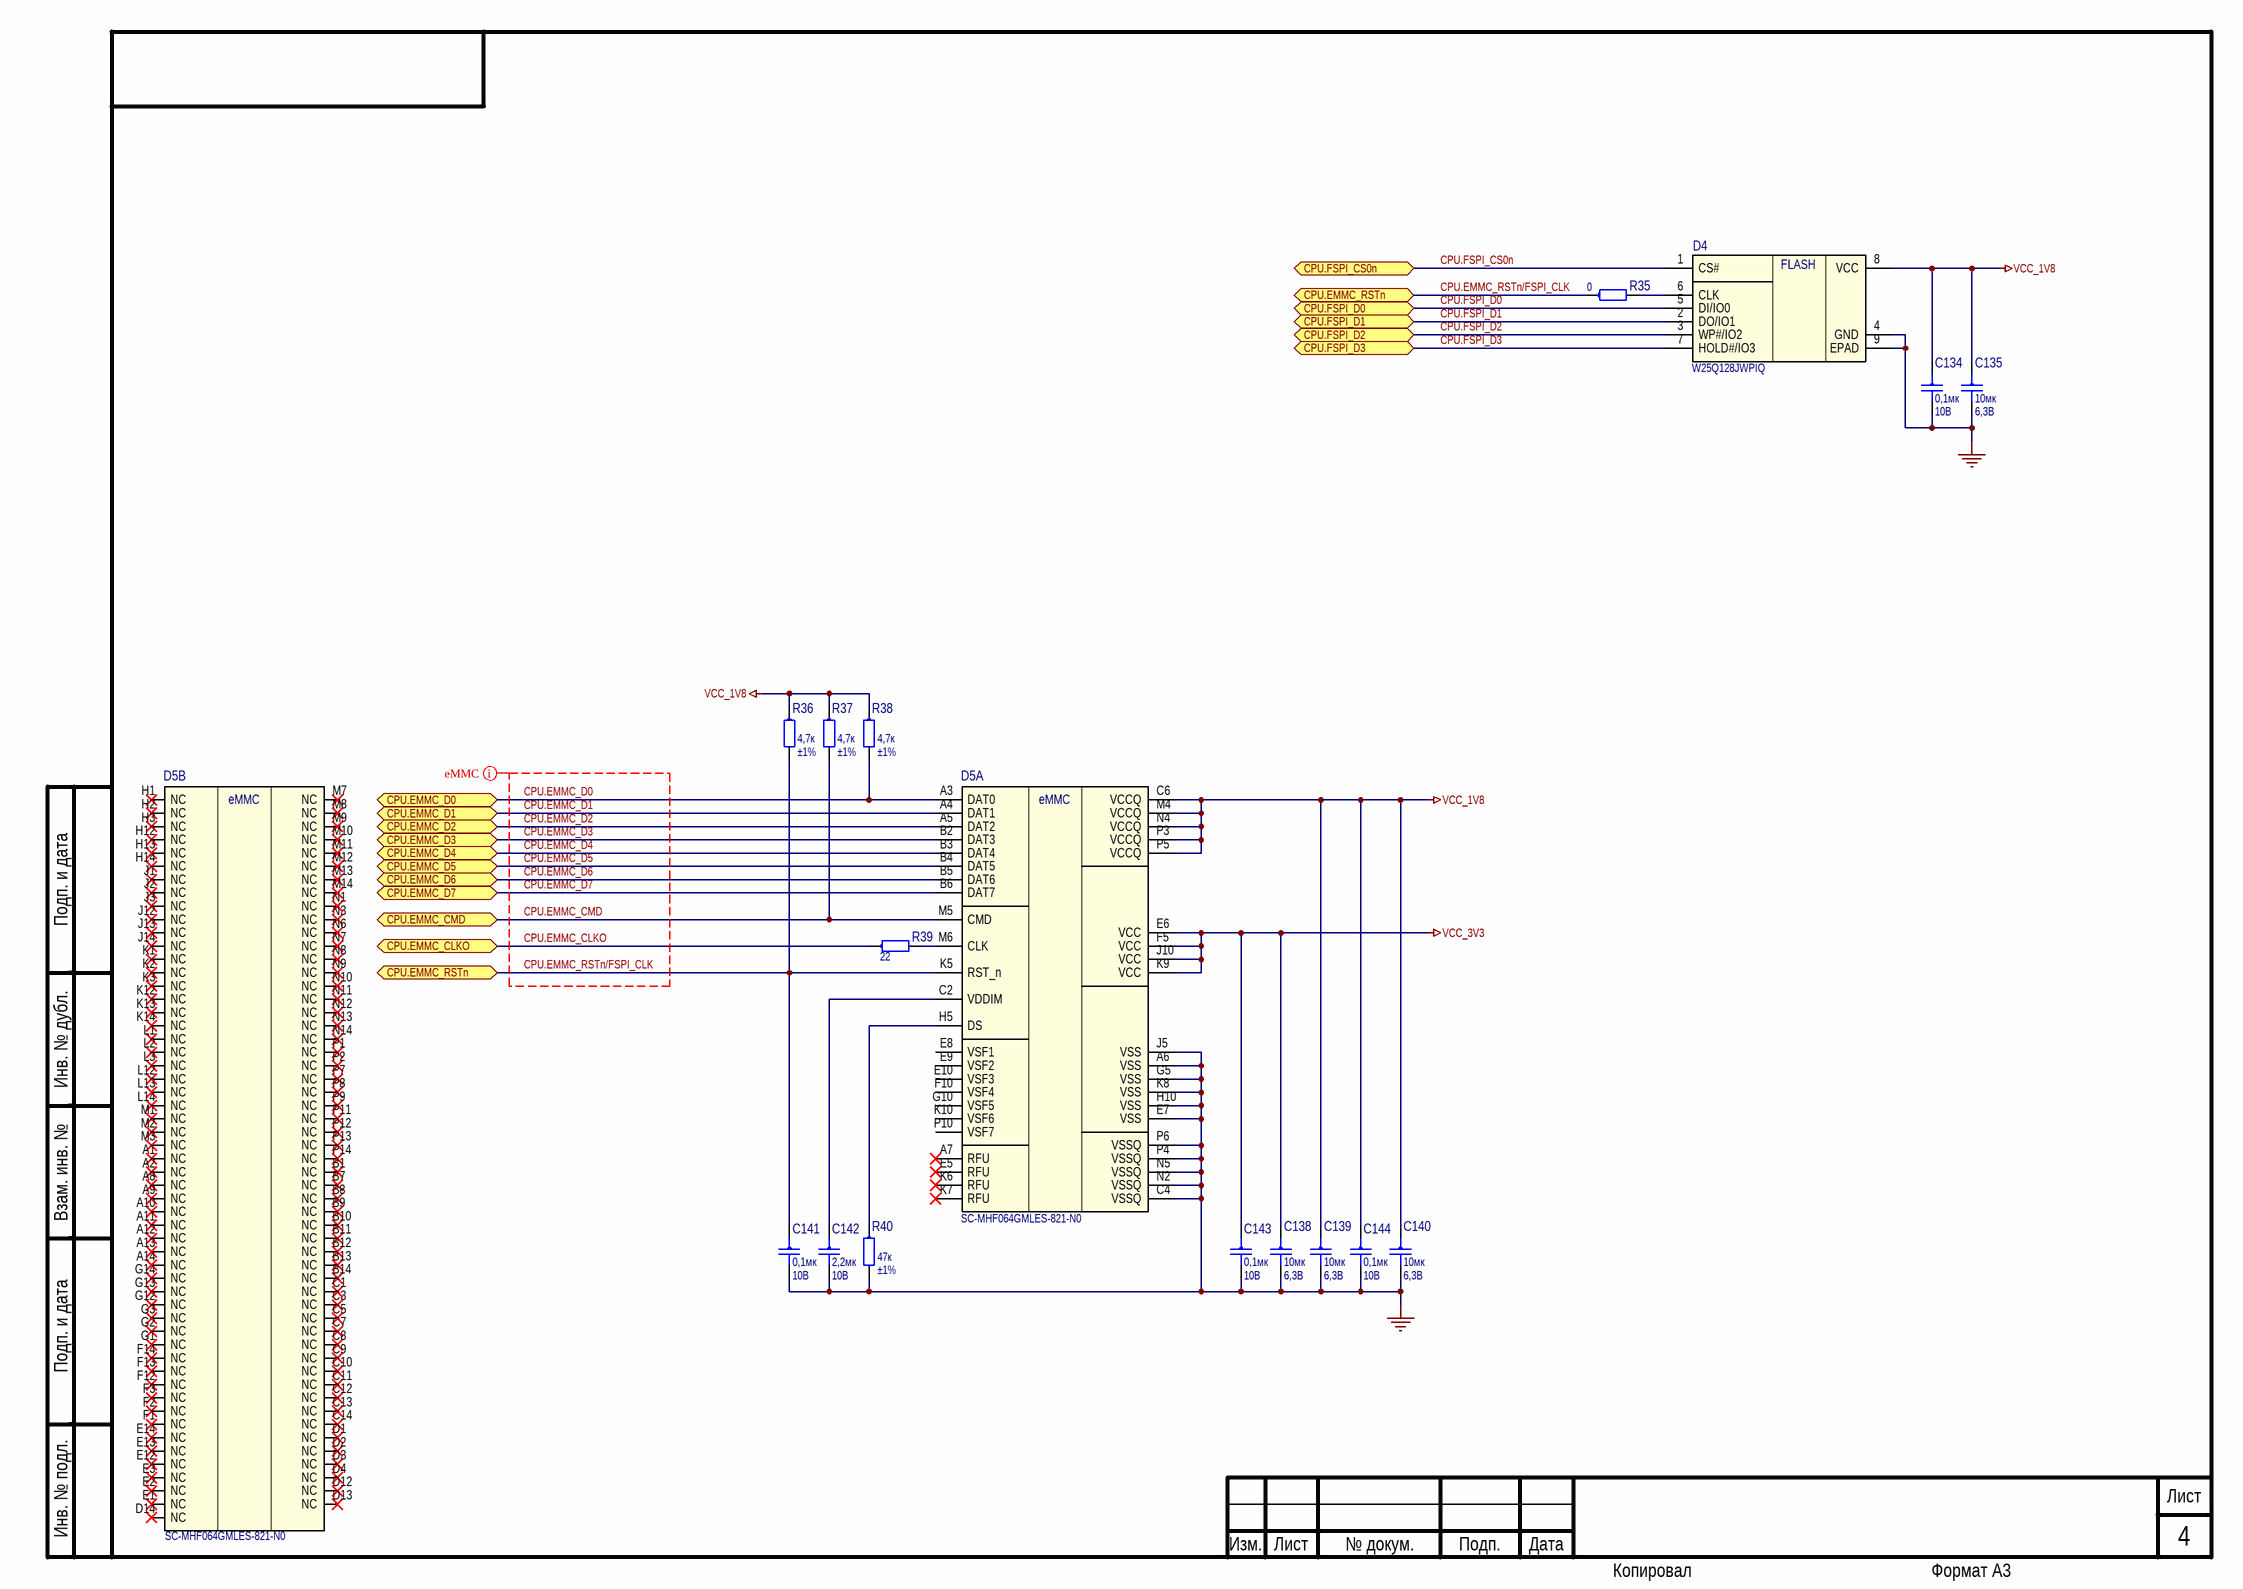
[diagram p6: RK3576-SMC.EMMC (0021.0 A0).SchDoc]

### Parts
C134  0,1мк  Напряжение: 10В  [capc1005x55n]
C135  10мк  Напряжение: 6,3В  [capc1005x70n]
C138  10мк  Напряжение: 6,3В  [capc1005x70n]
C139  10мк  Напряжение: 6,3В  [capc1005x70n]
C140  10мк  Напряжение: 6,3В  [capc1005x70n]
C141  0,1мк  Напряжение: 10В  [capc1005x55n]
C142  2,2мк  Напряжение: 10В  [capc1005x55n]
C143  0,1мк  Напряжение: 10В  [capc1005x55n]
C144  0,1мк  Напряжение: 10В  [capc1005x55n]
D4  W25Q128JWPIQ  [son127p600x500x80-9_hsn_v1]
D5  SC-MHF064GMLES-821-N0  [bga153c50p14x14_1150x1300x100]  (parts A,B of 2)
R35  0  [resc1005x40n]
R36  4,7к  Точность: ±1%  [resc1005x40n]
R37  4,7к  Точность: ±1%  [resc1005x40n]
R38  4,7к  Точность: ±1%  [resc1005x40n]
R39  22  [resc1005x40n]
R40  47к  Точность: ±1%  [resc1005x40n]

### Ports
CPU.EMMC_CLKO (bidir), CPU.EMMC_CMD (bidir), CPU.EMMC_D0 (bidir), CPU.EMMC_D1 (bidir), CPU.EMMC_D2 (bidir), CPU.EMMC_D3 (bidir), CPU.EMMC_D4 (bidir), CPU.EMMC_D5 (bidir), CPU.EMMC_D6 (bidir), CPU.EMMC_D7 (bidir), CPU.EMMC_RSTn (bidir), CPU.FSPI_CS0n (bidir), CPU.FSPI_D0 (bidir), CPU.FSPI_D1 (bidir), CPU.FSPI_D2 (bidir), CPU.FSPI_D3 (bidir)

### Nets
DEV.GND: C134.2 C135.2 C138.2 C139.2 C140.2 C141.2 C142.2 C143.2 C144.2 D4.4(GND) D4.9(EPAD) D5.A6(VSS) D5.C4(VSSQ) D5.E7(VSS) D5.G5(VSS) D5.H10(VSS) D5.J5(VSS) D5.K8(VSS) D5.N2(VSSQ) D5.N5(VSSQ) D5.P4(VSSQ) D5.P6(VSSQ) R40.2
VCC_1V8: C134.1 C135.1 C139.1 C140.1 C144.1 D4.8(VCC) D5.C6(VCCQ) D5.M4(VCCQ) D5.N4(VCCQ) D5.P3(VCCQ) D5.P5(VCCQ) R36.1 R37.1 R38.1
VCC_3V3: C138.1 C143.1 D5.E6(VCC) D5.F5(VCC) D5.J10(VCC) D5.K9(VCC)
CPU.EMMC_CLKO: R39.1 ; port CPU.EMMC_CLKO
CPU.EMMC_CMD: D5.M5(CMD) R37.2 ; port CPU.EMMC_CMD
CPU.EMMC_D0: D5.A3(DAT0) R38.2 ; port CPU.EMMC_D0
CPU.EMMC_D1: D5.A4(DAT1) ; port CPU.EMMC_D1
CPU.EMMC_D2: D5.A5(DAT2) ; port CPU.EMMC_D2
CPU.EMMC_D3: D5.B2(DAT3) ; port CPU.EMMC_D3
CPU.EMMC_D4: D5.B3(DAT4) ; port CPU.EMMC_D4
CPU.EMMC_D5: D5.B4(DAT5) ; port CPU.EMMC_D5
CPU.EMMC_D6: D5.B5(DAT6) ; port CPU.EMMC_D6
CPU.EMMC_D7: D5.B6(DAT7) ; port CPU.EMMC_D7
CPU.EMMC_RSTn/FSPI_CLK: C141.1 D5.K5(RST_n) R35.1 R36.2 ; port CPU.EMMC_RSTn
CPU.FSPI_CS0n: D4.1(CS#) ; port CPU.FSPI_CS0n
CPU.FSPI_D0: D4.5(DI/IO0) ; port CPU.FSPI_D0
CPU.FSPI_D1: D4.2(DO/IO1) ; port CPU.FSPI_D1
CPU.FSPI_D2: D4.3(WP#/IO2) ; port CPU.FSPI_D2
CPU.FSPI_D3: D4.7(HOLD#/IO3) ; port CPU.FSPI_D3
NetC142_1: C142.1 D5.C2(VDDIM)
NetD4_6: D4.6(CLK) R35.2
NetD5_H5: D5.H5(DS) R40.1
NetD5_M6: D5.M6(CLK) R39.2

Not connected (* = marked no-connect by the designer): D5 A1(NC)* A2(NC)* A7(RFU)* A8(NC)* A9(NC)* A10(NC)* A11(NC)* A12(NC)* A13(NC)* A14(NC)* B1(NC)* B7(NC)* B8(NC)* B9(NC)* B10(NC)* B11(NC)* B12(NC)* B13(NC)* B14(NC)* C1(NC)* C3(NC)* C5(NC)* C7(NC)* C8(NC)* C9(NC)* C10(NC)* C11(NC)* C12(NC)* C13(NC)* C14(NC)* D1(NC)* D2(NC)* D3(NC)* D4(NC)* D12(NC)* D13(NC)* D14(NC)* E1(NC)* E2(NC)* E3(NC)* E5(RFU)* E8(VSF1) E9(VSF2) E10(VSF3) E12(NC)* E13(NC)* E14(NC)* F1(NC)* F2(NC)* F3(NC)* F10(VSF4) F12(NC)* F13(NC)* F14(NC)* G1(NC)* G2(NC)* G3(NC)* G10(VSF5) G12(NC)* G13(NC)* G14(NC)* H1(NC)* H2(NC)* H3(NC)* H12(NC)* H13(NC)* H14(NC)* J1(NC)* J2(NC)* J3(NC)* J12(NC)* J13(NC)* J14(NC)* K1(NC)* K2(NC)* K3(NC)* K6(RFU)* K7(RFU)* K10(VSF6) K12(NC)* K13(NC)* K14(NC)* L1(NC)* L2(NC)* L3(NC)* L12(NC)* L13(NC)* L14(NC)* M1(NC)* M2(NC)* M3(NC)* M7(NC)* M8(NC)* M9(NC)* M10(NC)* M11(NC)* M12(NC)* M13(NC)* M14(NC)* N1(NC)* N3(NC)* N6(NC)* N7(NC)* N8(NC)* N9(NC)* N10(NC)* N11(NC)* N12(NC)* N13(NC)* N14(NC)* P1(NC)* P2(NC)* P7(NC)* P8(NC)* P9(NC)* P10(VSF7) P11(NC)* P12(NC)* P13(NC)* P14(NC)*

### Layout directives
net class eMMC; rule Length Constraint [Min Length = 0mm    Max Length = 150mm]; rule Width Constraint [Pref Impedance = 50,00ohms    Min Impedance = 50,00ohms    Max Impedance = 50,00ohms]: CPU.EMMC_CLKO, CPU.EMMC_CMD, CPU.EMMC_D0, CPU.EMMC_D1, CPU.EMMC_D2, CPU.EMMC_D3, CPU.EMMC_D4, CPU.EMMC_D5, CPU.EMMC_D6, CPU.EMMC_D7, CPU.EMMC_RSTn/FSPI_CLK

### Notes on the sheet
- Подп. и дата
- Инв. № дубл.
- Взам. инв. №
- Инв. № подл.
- Изм.
- Лист
- № докум.
- Подп.
- Дата
- Копировал
- Формат А3
- (in symbol W25Q128JWPIQ) FLASH

### Library data of the parts
C134 C141 C143 C144 = C0402C104K8RAC: as C107 on sheet RK3576-SMC.LPDDR4 (0021.0 A0); Part Number: C0402C104K8RAC; Datasheet: Kemet_6.3-250V_X7R.pdf; Номинал: 0,1мк; Part_Number: C0402C104K8RAC; Height: 0.55; Производитель: Kemet; Website: https://content.kemet.com/datasheets/KEM_C1002_X7R_SMD.pdf; Дата: 16.10.2024; ComponentLink1Description: Kemet_6.3-250V_X7R.pdf; ComponentLink1URL: https://content.kemet.com/datasheets/KEM_C1002_X7R_SMD.pdf; NameFromManufacturer: C0402C104K8RAC; Original PN: C0402C104K8RAC
C135 C138-C140 = CC0402KRX5R5BB106: Part_ID: ATB-01033; Manufacturer: Yageo; Schematic_Part: C_min_val,C_min,C_val,C; Тип ЭКБ: Конденсаторы; Наименование: 0402-X5R-6.3V-10uF±10%; Тип компонента: Конденсатор керамический; Value: 10uF; Voltage: 6.3V; Температура: -55 +85; PCB_Footprint: capc1005x70,capc1005x70n; Тип корпуса: Chip; Видоразмер: 1005; Вариант установки: Поверхностный; Код ERP: E2-00020067; Photo: Yageo_Capacitors.jpg; Автор: Чепиков И.В.; Точность: 10%; Device: 0402-X5R-6.3V-10uF±10%_Yageo; Library Ref 2: C; Library Ref 3: Cshort; Part Number: CC0402KRX5R5BB106; Datasheet: UPY-GPHC_X5R_4V-to-50V_30.pdf; Номинал: 10мк; Part_Number: CC0402KRX5R5BB106; Height: 0.7; Производитель: Yageo; Website: https://www.yageo.com/upload/media/product/productsearch/datasheet/mlcc/UPY-GPHC_X5R_4V-to-50V_30.pdf; Дата: 25.09.2024; ComponentLink1Description: UPY-GPHC_X5R_4V-to-50V_30.pdf; ComponentLink1URL: https://www.yageo.com/upload/media/product/productsearch/datasheet/mlcc/UPY-GPHC_X5R_4V-to-50V_30.pdf; NameFromManufacturer: CC0402KRX5R5BB106; Original PN: CC0402KRX5R5BB106
C142 = CC0402KRX5R6BB225: Part_ID: ATB-01028; Manufacturer: Yageo; Schematic_Part: C_min_val,C_min,C_val,C; Тип ЭКБ: Конденсаторы; Наименование: 0402-X5R-10V-2.2uF±10%; Тип компонента: Конденсатор керамический; Value: 2.2uF; Voltage: 10V; Температура: -55 +85; PCB_Footprint: capc1005x55,capc1005x55n; Тип корпуса: Chip; Видоразмер: 1005; Вариант установки: Поверхностный; Код ERP: E2-00005144; Photo: Yageo_Capacitors.jpg; Автор: Чепиков И.В.; Точность: 10%; Device: 0402-X5R-10V-2.2uF±10%_Yageo; Library Ref 2: C; Library Ref 3: Cshort; Part Number: CC0402KRX5R6BB225; Datasheet: UPY-GPHC_X5R_4V-to-50V_30.pdf; Номинал: 2,2мк; Part_Number: CC0402KRX5R6BB225; Height: 0.55; Производитель: Yageo; Website: https://www.yageo.com/upload/media/product/productsearch/datasheet/mlcc/UPY-GPHC_X5R_4V-to-50V_30.pdf; Дата: 25.09.2024; ComponentLink1Description: UPY-GPHC_X5R_4V-to-50V_30.pdf; ComponentLink1URL: https://www.yageo.com/upload/media/product/productsearch/datasheet/mlcc/UPY-GPHC_X5R_4V-to-50V_30.pdf; NameFromManufacturer: CC0402KRX5R6BB225; Original PN: CC0402KRX5R6BB225
D4 = W25Q128JWPIQ: Serial Flash Memory With Dual, Quad SPI 1.8V 128M-BIT; Part_ID: ATB-00417; Manufacturer: Winbond; Тип ЭКБ: Микросхемы; Voltage: 1.7 - 1.95; Температура: -40 +85; Тип корпуса: SON6x5-8; Вариант установки: Поверхностный; Код ERP: E2-00012969; Photo: Winbond_W25Q128JWPIQ.jpg; Автор: Чепиков И.В.; Part Number: W25Q128JWPIQ; Наименование: W25Q128JWPIQ; Datasheet: W25Q128JW_RevH.pdf; Тип компонента: Flash; Schematic_Part: W25Q128JWPIQ; Value: W25Q128JWPIQ; Part_Number: W25Q128JWPIQ; PCB_Footprint: son127p600x500x80-9_hsn_v1; Height: 0.8; Производитель: Winbond; Website: https://www.winbond.com/hq/search/newIndex.jsp?q=W25Q128JWPIQ&__locale=en; Дата: 11.07.2024; Device: W25Q128JWPIQ; ComponentLink1Description: W25Q128JW_RevH.pdf; ComponentLink1URL: https://www.winbond.com/hq/search/newIndex.jsp?q=W25Q128JWPIQ&__locale=en; NameFromManufacturer: W25Q128JWPIQ; Original PN: W25Q128JWPIQ
D5 = SC-MHF064GMLES-821-N0: Industrial & Automotive eMMC 5.1 (MEMA series) TLC 64Gb; Part_ID: ATB-00558; Manufacturer: Phison; Тип ЭКБ: Микросхемы; Voltage: 1.8 - 3.3; Температура: -40 +85; Тип корпуса: BGA11.5x13-153; Вариант установки: Поверхностный; Код ERP: E2-00012968; Photo: SanDisk_SDINBDA4-64G.jpg; Автор: Чепиков И.В.; Part Number: SC-MHF064GMLES-821-N0; Наименование: SC-MHF064GMLES-821-N0; Datasheet: SC-MHF064GMLES.pdf; Тип компонента: eMMC; Schematic_Part: MTFC64GAPALBH-AIT; Value: SC-MHF064GMLES-821-N0; Part_Number: SC-MHF064GMLES-821-N0; PCB_Footprint: bga153c50p14x14_1150x1300x100; Height: 1; Weight: 0.3; Производитель: Phison; Дата: 28.08.2024; Device: SC-MHF064GMLES-821-N0; ComponentLink1Description: SC-MHF064GMLES.pdf; NameFromManufacturer: SC-MHF064GMLES-821-N0; Original PN: SC-MHF064GMLES-821-N0
R35 = RC0402JR-070RL: as R34 on sheet RK3576-SMC.LPDDR4 (0021.0 A0); Part Number: RC0402JR-070RL; Datasheet: PYu-RC_Group_51_RoHS_L_12.pdf; Номинал: 0; Value: 0; Part_Number: RC0402JR-070RL; PCB_Footprint: resc1005x40n; Height: 0.4; Производитель: Yageo; Website: https://www.yageo.com/upload/media/product/products/datasheet/rchip/PYu-RC_Group_51_RoHS_L_12.pdf; Дата: 25.09.2024; NameFromManufacturer: RC0402JR-070RL; ComponentLink1URL: https://www.yageo.com/upload/media/product/products/datasheet/rchip/PYu-RC_Group_51_RoHS_L_12.pdf; ComponentLink1Description: PYu-RC_Group_51_RoHS_L_12.pdf; Original PN: RC0402JR-070RL
R36-R38 = RC0402FR-074K7L: Part_ID: ATB-00516; Manufacturer: Yageo; Schematic_Part: R_min_val,R_min,R_val,R; Тип ЭКБ: Резисторы; Наименование: 0402-0.063W-4.7K-100ppm±1%; Тип компонента: Резистор; Value: 4.7k; Voltage: 50V; Power: 0.063; ТКС (от  -60 до +20 град): ± 100; Ряд: E24; Температура: -55 +155; Тип корпуса: Chip; Вариант установки: Поверхностный; Код ERP: E2-00028493; Photo: Yageo_RC0075-RC2512.jpg; Автор: Чепиков И.В.; Device: 0402-0.063W-4.7K-100ppm±1%_Yageo; Library Ref 2: R; Part Number: RC0402FR-074K7L; Datasheet: PYu-RC_Group_51_RoHS_L_12.pdf; Номинал: 4,7к; ТКС (от +20 град до max): ± 100; Part_Number: RC0402FR-074K7L; PCB_Footprint: resc1005x40n; Height: 0.4; Производитель: Yageo; Website: https://www.yageo.com/upload/media/product/products/datasheet/rchip/PYu-RC_Group_51_RoHS_L_12.pdf; Дата: 23.08.2024; NameFromManufacturer: RC0402FR-074K7L; ComponentLink1URL: https://www.yageo.com/upload/media/product/products/datasheet/rchip/PYu-RC_Group_51_RoHS_L_12.pdf; ComponentLink1Description: PYu-RC_Group_51_RoHS_L_12.pdf; Original PN: RC0402FR-074K7L
R39 = RC0402FR-0722RL: Part_ID: ATB-00511; Manufacturer: Yageo; Schematic_Part: R_min_val,R_min,R_val,R; Тип ЭКБ: Резисторы; Наименование: 0402-0.063W-22R-100ppm±1%; Тип компонента: Резистор; Voltage: 50V; Power: 0.063; Точность: ±1%; ТКС (от  -60 до +20 град): ± 100; Ряд: E24; Температура: -55 +155; Тип корпуса: Chip; Вариант установки: Поверхностный; Код ERP: E2-00028484; Photo: Yageo_RC0075-RC2512.jpg; Автор: Чепиков И.В.; Device: 0402-0.063W-22R-100ppm±1%_Yageo; Library Ref 2: R; Part Number: RC0402FR-0722RL; Datasheet: PYu-RC_Group_51_RoHS_L_12.pdf; Номинал: 22; Value: 22; ТКС (от +20 град до max): ± 100; Part_Number: RC0402FR-0722RL; PCB_Footprint: resc1005x40n; Height: 0.4; Производитель: Yageo; Website: https://www.yageo.com/upload/media/product/products/datasheet/rchip/PYu-RC_Group_51_RoHS_L_12.pdf; Дата: 23.08.2024; NameFromManufacturer: RC0402FR-0722RL; ComponentLink1URL: https://www.yageo.com/upload/media/product/products/datasheet/rchip/PYu-RC_Group_51_RoHS_L_12.pdf; ComponentLink1Description: PYu-RC_Group_51_RoHS_L_12.pdf; Original PN: RC0402FR-0722RL
R40 = RC0402FR-0747KL: Part_ID: ATB-00827; Manufacturer: Yageo; Schematic_Part: R_min_val,R_min,R_val,R; Тип ЭКБ: Резисторы; Наименование: 0402-0.063W-47K-100ppm±1%; Тип компонента: Резистор; Value: 47k; Voltage: 50V; Power: 0.063; ТКС (от  -60 до +20 град): ± 100; Ряд: E24; Температура: -55 +155; Тип корпуса: Chip; Вариант установки: Поверхностный; Код ERP: E2-00028165; Photo: Yageo_RC0075-RC2512.jpg; Автор: Чепиков И.В.; Device: 0402-0.063W-47K-100ppm±1%_Yageo; Library Ref 2: R; Part Number: RC0402FR-0747KL; Datasheet: PYu-RC_Group_51_RoHS_L_12.pdf; Номинал: 47к; ТКС (от +20 град до max): ± 100; Part_Number: RC0402FR-0747KL; PCB_Footprint: resc1005x40n; Height: 0.4; Производитель: Yageo; Website: https://www.yageo.com/upload/media/product/products/datasheet/rchip/PYu-RC_Group_51_RoHS_L_12.pdf; Дата: 25.09.2024; NameFromManufacturer: RC0402FR-0747KL; ComponentLink1URL: https://www.yageo.com/upload/media/product/products/datasheet/rchip/PYu-RC_Group_51_RoHS_L_12.pdf; ComponentLink1Description: PYu-RC_Group_51_RoHS_L_12.pdf; Original PN: RC0402FR-0747KL

## Nets that join several sheets
+3V3: RK3576-SMC.SMARC_1 (0021.0 A0) (R?#7.2 R?#20.2), RK3576-SMC.SMARC_3 (0021.0 A0) (R?#42.2)
+5V0_SYS: RK3576-SMC.SMARC_1 (0021.0 A0) (10 pins), RK3576-SMC.PMIC_BUCK (0021.0 A0) (22 pins), RK3576-SMC.PMIC_LDO (0021.0 A0) (C?#66.1 C?#68.1 D?#3.21 R?#64.2)
DEV.GND: RK3576-SMC.LPDDR4 (0021.0 A0) (87 pins), RK3576-SMC.EMMC (0021.0 A0) (23 pins)
SOM.GND: RK3576-SMC.SMARC_3 (0021.0 A0) (49 pins), RK3576-SMC.PMIC_BUCK (0021.0 A0) (46 pins), RK3576-SMC.PMIC_LDO (0021.0 A0) (21 pins)
CPU.I2C4_SCL: RK3576-SMC.SMARC_1 (0021.0 A0) (R?#35.2), RK3576-SMC.SMARC_2 (0021.0 A0) (R?#38.2)
CPU.I2C4_SDA: RK3576-SMC.SMARC_1 (0021.0 A0) (R?#36.2), RK3576-SMC.SMARC_2 (0021.0 A0) (R?#39.2)